# Altium schematic sheet Titan_Balancer_0.SchDoc: Titan_Balancer
size 409 x 289 mm; Origin: Eagle; Date: 5/25/2021 7:31:24 PM; SheetNumber: 1; Value: a; GateName_1: G$1; SymbolName_1: A3L-LOC; LibraryName: frames; DeviceSetName: A3L-LOC; Sheet: Sheet:
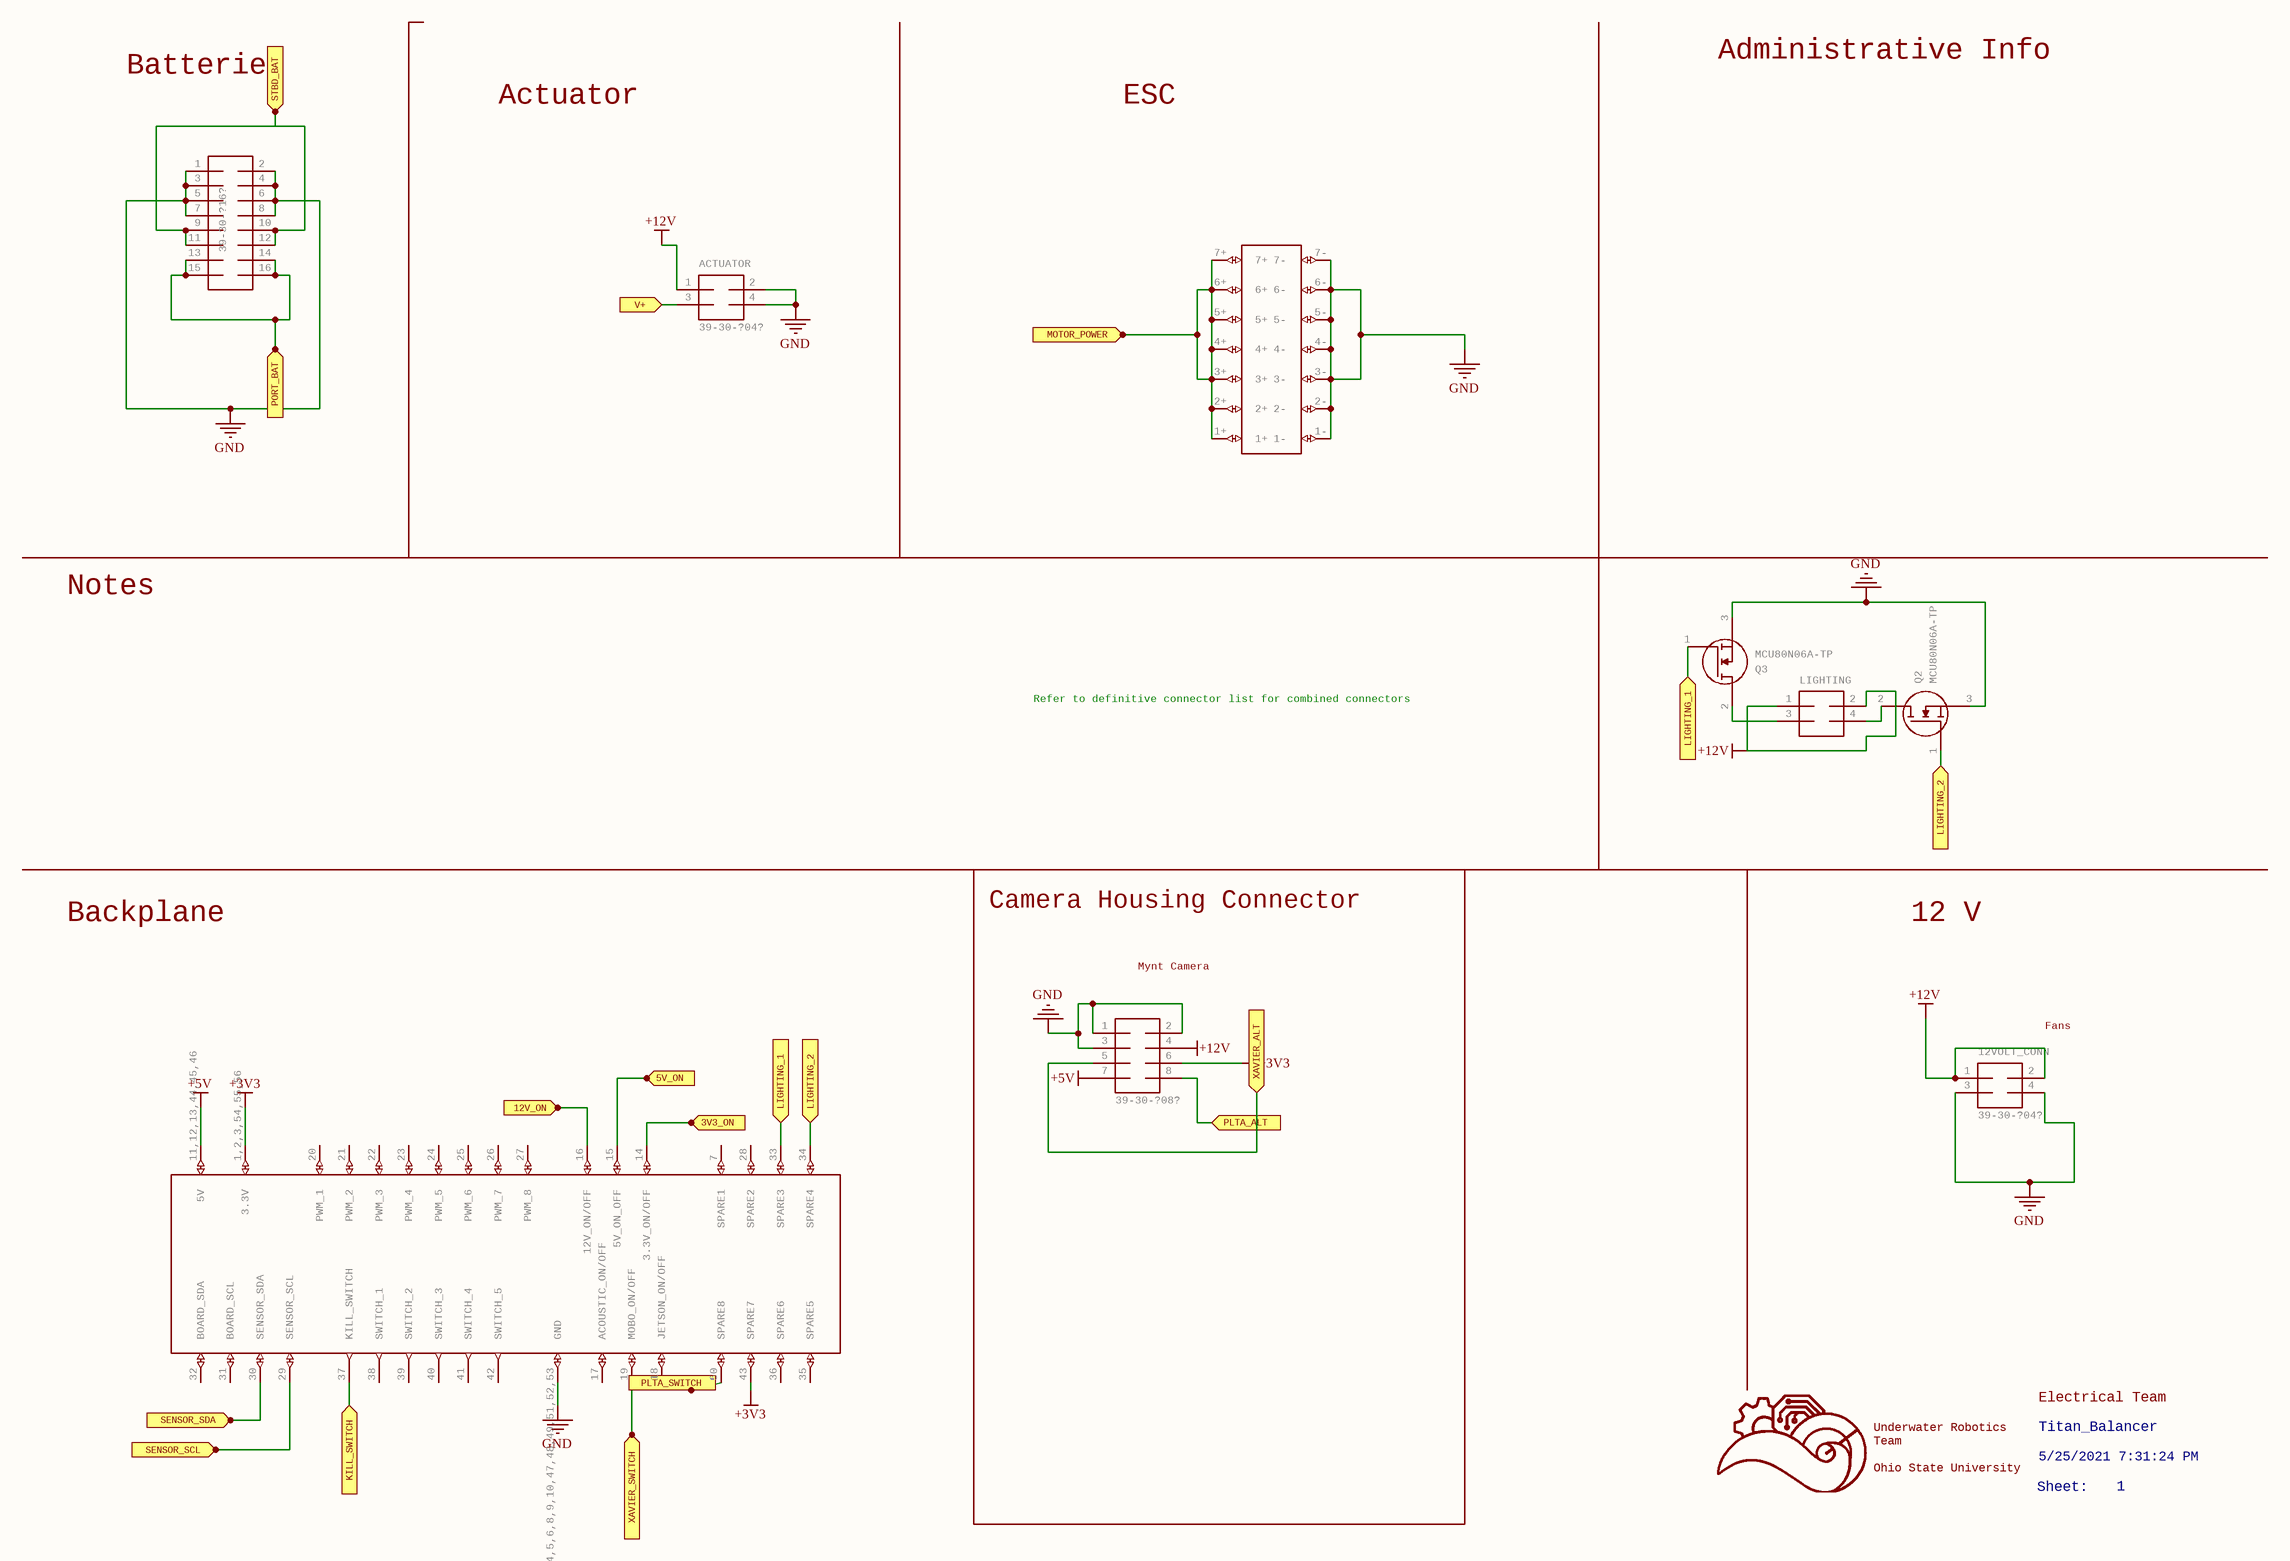
[diagram p0: Titan_Balancer_0.SchDoc]

## Parts
12VOLT_CONN  39-30-?04?  [39-30-?04?]
ACTUATOR  39-30-?04?  [39-30-?04?]
BATTERYCONNECTOR  39-30-?16?  [39-30-?16?]
ESC_CONN  14PIN-VERT  [14PIN_VERT]  (value not drawn)
LIGHTING  39-30-?04?  [39-30-?04?]  (value not drawn)
MYNT_XAVIER_PLTA  39-30-?08?  [39-30-?08?]
Q2  MCU80N06A-TP  [FDD8453LZ]
Q3  MCU80N06A-TP  [FDD8453LZ]
U$1  5530843-EDGE  [5530843-6-BOARDFINGERS]  (value not drawn)

## Ports
3V3_ON (in), 5V_ON (in), 12V_ON (in), KILL_SWITCH (in), LIGHTING_1 (in), LIGHTING_2 (in), MOTOR_POWER (in), PLTA_ALT (in), PLTA_SWITCH (in), PORT_BAT (in), SENSOR_SCL (in), SENSOR_SDA (in), STBD_BAT (in), V+ (in), XAVIER_ALT (in), XAVIER_SWITCH (in)

## Nets
+3V3: MYNT_XAVIER_PLTA.6 U$1.1,2,3,54,55,56(3.3V) U$1.43(SPARE7)
+5V: MYNT_XAVIER_PLTA.7 U$1.11,12,13,44,45,46(5V)
+12V: 12VOLT_CONN.1 12VOLT_CONN.2 ACTUATOR.1 LIGHTING.1 LIGHTING.2 MYNT_XAVIER_PLTA.4
GND: 12VOLT_CONN.3 12VOLT_CONN.4 ACTUATOR.2 ACTUATOR.4 BATTERYCONNECTOR.1 BATTERYCONNECTOR.2 BATTERYCONNECTOR.3 BATTERYCONNECTOR.4 BATTERYCONNECTOR.5 BATTERYCONNECTOR.6 BATTERYCONNECTOR.7 BATTERYCONNECTOR.8 ESC_CONN.1- ESC_CONN.2- ESC_CONN.3- ESC_CONN.4- ESC_CONN.5- ESC_CONN.6- ESC_CONN.7- MYNT_XAVIER_PLTA.1 MYNT_XAVIER_PLTA.2 MYNT_XAVIER_PLTA.3 Q2.3(S) Q3.3(S) U$1.4,5,6,8,9,10,47,48,49,51,52,53(GND)
3V3_ON: U$1.14(3.3V_ON/OFF) ; port 3V3_ON
5V_ON: U$1.15(5V_ON_OFF) ; port 5V_ON
12V_ON: U$1.16(12V_ON/OFF) ; port 12V_ON
KILL_SWITCH: U$1.37(KILL_SWITCH) ; port KILL_SWITCH
LIGHTING_1: Q3.1(G) U$1.33(SPARE3) ; port LIGHTING_1
LIGHTING_2: Q2.1(G) U$1.34(SPARE4) ; port LIGHTING_2
MOTOR_POWER: ESC_CONN.1+ ESC_CONN.2+ ESC_CONN.3+ ESC_CONN.4+ ESC_CONN.5+ ESC_CONN.6+ ESC_CONN.7+ ; port MOTOR_POWER
PLTA_ALT: MYNT_XAVIER_PLTA.8 ; port PLTA_ALT
PORT_BAT: BATTERYCONNECTOR.13 BATTERYCONNECTOR.14 BATTERYCONNECTOR.15 BATTERYCONNECTOR.16 ; port PORT_BAT
SENSOR_SCL: U$1.29(SENSOR_SCL) ; port SENSOR_SCL
SENSOR_SDA: U$1.30(SENSOR_SDA) ; port SENSOR_SDA
STBD_BAT: BATTERYCONNECTOR.9 BATTERYCONNECTOR.10 BATTERYCONNECTOR.11 BATTERYCONNECTOR.12 ; port STBD_BAT
V+: ACTUATOR.3 ; port V+
XAVIER_ALT: MYNT_XAVIER_PLTA.5 ; port XAVIER_ALT
XAVIER_SWITCH: U$1.19(MOBO_ON/OFF) ; port XAVIER_SWITCH
NetLIGHTING_3: LIGHTING.3 Q3.2(D)
NetLIGHTING_4: LIGHTING.4 Q2.2(D)

Not connected (* = marked no-connect by the designer): U$1 7(SPARE1) 17(ACOUSTIC_ON/OFF) 18(JETSON_ON/OFF) 20(PWM_1) 21(PWM_2) 22(PWM_3) 23(PWM_4) 24(PWM_5) 25(PWM_6) 26(PWM_7) 27(PWM_8) 28(SPARE2) 31(BOARD_SCL) 32(BOARD_SDA) 35(SPARE5) 36(SPARE6) 38(SWITCH_1) 39(SWITCH_2) 40(SWITCH_3) 41(SWITCH_4) 42(SWITCH_5) 50(SPARE8)

## Notes on the sheet
- Batteries
- Actuator
- ESC
- Administrative Info
- Notes
- Refer to definitive connector list for combined connectors
- Backplane
- Camera Housing Connector
- 12 V
- Mynt Camera
- (near 12VOLT_CONN) Fans
- Electrical Team
- Titan_Balancer
- Underwater Robotics
  Team
  Ohio State University
- Sheet:
- 5/25/2021 7:31:24 PM
- 1

## Library data of the parts
12VOLT_CONN ACTUATOR LIGHTING = 39-30-?04?: HEADER; GateName_1: G$1; SymbolName_1: MA02-2; LibraryName: con-molex-mini-fit; DeviceSetName: 39-30-?04?
BATTERYCONNECTOR = 39-30-?16?: HEADER; GateName_1: G$1; SymbolName_1: MA08-2; LibraryName: con-molex-mini-fit; DeviceSetName: 39-30-?16?
ESC_CONN = 14PIN-VERT: GateName_1: G$1; SymbolName_1: 14PIN_VERT; LibraryName: Vertical_Connectors; DeviceSetName: 14PIN-VERT
MYNT_XAVIER_PLTA = 39-30-?08?: HEADER; GateName_1: G$1; SymbolName_1: MA04-2; LibraryName: con-molex-mini-fit; DeviceSetName: 39-30-?08?
Q2 Q3 = FDD8453LZ: FDD8453LZ N-Channel MOSFET, 16 A, 40 V PowerTrench, 3-Pin DPAK ON Semiconductor   Source:  Datasheet; GateName_1: G$1; SymbolName_1: FDD8453LZ; LibraryName: FDD8453LZ; DeviceSetName: FDD8453LZ; ARROW_PART_NUMBER: ARROW_PART_NUMBER; ARROW_PRICE-STOCK: ARROW_PRICE-STOCK; HEIGHT: 2.39mm; MANUFACTURER_NAME: ON Semiconductor; MANUFACTURER_PART_NUMBER: FDD8453LZ; MOUSER_PART_NUMBER: 512-FDD8453LZ; MOUSER_PRICE-STOCK: https://www.mouser.com/Search/Refine.aspx?Keyword=512-FDD8453LZ
U$1 = 5530843-EDGE: GateName_1: G$1; SymbolName_1: 5530843-6; LibraryName: 5530843-6; DeviceSetName: 5530843-EDGE